# EAGLE schematic host (EAGLE 7.1.0)
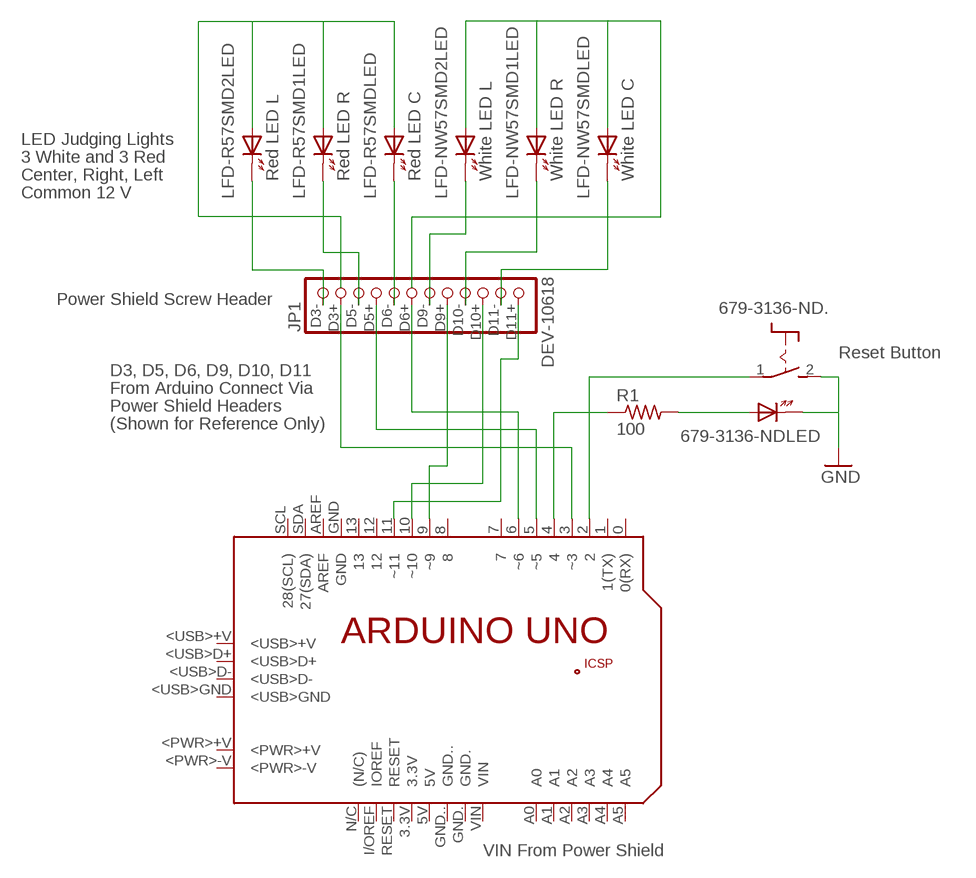
[diagram p0: schematic, sheet 1]

## Parts
679-3136-ND  MARQ6425  [MARQ6425]
JP1  DEV-10618  PINHD-1X12  [1X12]
LFD-NW57SMD  White LED C  MARQ6425  [MARQ6425]
LFD-NW57SMD1  White LED R  MARQ6425  [MARQ6425]
LFD-NW57SMD2  White LED L  MARQ6425  [MARQ6425]
LFD-R57SMD  Red LED C  MARQ6425  [MARQ6425]
LFD-R57SMD1  Red LED R  MARQ6425  [MARQ6425]
LFD-R57SMD2  Red LED L  MARQ6425  [MARQ6425]
PCB1  ARDUINO_UNO  [ARDUINO_UNO]
R1  100  R-US_0204/2V  [0204V]

## Nets
GND: 679-3136-ND.2(.:S) 679-3136-ND.K(LED:K)
N$1: 679-3136-ND.1(.:P) PCB1.2
N$2: PCB1.4 R1.1
N$3: JP1.D11+ PCB1.11(~11)
N$4: JP1.D10+ PCB1.10(~10)
N$5: JP1.D9+ PCB1.9(~9)
N$6: JP1.D3+ PCB1.3(~3)
N$7: JP1.D5+ PCB1.5(~5)
N$8: JP1.D6+ PCB1.6(~6)
N$9: 679-3136-ND.A(LED:A) R1.2
N$10: JP1.D3- LFD-R57SMD2.K(LED:K)
N$11: JP1.D5- LFD-R57SMD1.K(LED:K)
N$12: JP1.D6- LFD-R57SMD.K(LED:K)
N$13: JP1.D11- LFD-NW57SMD.K(LED:K)
N$14: JP1.D10- LFD-NW57SMD1.K(LED:K)
N$15: JP1.D9- LFD-NW57SMD2.K(LED:K)
N$16: LFD-R57SMD1.A(LED:A) LFD-R57SMD2.A(LED:A) LFD-R57SMD.A(LED:A)
N$17: LFD-NW57SMD1.A(LED:A) LFD-NW57SMD2.A(LED:A) LFD-NW57SMD.A(LED:A)
Unconnected: LFD-NW57SMD1.1(.:P) LFD-NW57SMD1.2(.:S) LFD-NW57SMD2.1(.:P) LFD-NW57SMD2.2(.:S) LFD-NW57SMD.1(.:P) LFD-NW57SMD.2(.:S) LFD-R57SMD1.1(.:P) LFD-R57SMD1.2(.:S) LFD-R57SMD2.1(.:P) LFD-R57SMD2.2(.:S) LFD-R57SMD.1(.:P) LFD-R57SMD.2(.:S) PCB1.0(0(RX)) PCB1.1(1(TX)) PCB1.3.3V PCB1.5V PCB1.7 PCB1.8 PCB1.12 PCB1.13 PCB1.+5V PCB1.<PWR>+V PCB1.<PWR>-V PCB1.<USB>+V PCB1.<USB>D+ PCB1.<USB>D- PCB1.<USB>GND PCB1.A0 PCB1.A1 PCB1.A2 PCB1.A3 PCB1.A4 PCB1.A5 PCB1.AREF PCB1.GND PCB1.GND. PCB1.GND.. PCB1.GND_ PCB1.I/OREF(IOREF) PCB1.MISO PCB1.MOSI PCB1.N/C((N/C)) PCB1.RESET PCB1.RESET. PCB1.SCK PCB1.SCL(28(SCL)) PCB1.SDA(27(SDA)) PCB1.VIN

## Notes on the sheet
- LED Judging Lights
- 3 White and 3 Red
- Center, Right, Left
- Common 12 V
- Power Shield Screw Header
- Reset Button
- D3, D5, D6, D9, D10, D11
- From Arduino Connect Via
- Power Shield Headers
- (Shown for Reference Only)
- VIN From Power Shield

## Library data of the parts
679-3136-ND LFD-NW57SMD LFD-NW57SMD1 LFD-NW57SMD2 LFD-R57SMD LFD-R57SMD1 LFD-R57SMD2 = switch:MARQ6425: DIL SWITCH with LED, Marquardt
JP1 = adafruit:PINHD-1X12: PIN HEADER
PCB1 = E14_Arduino_published:ARDUINO_UNO: Device for representing an Arduino Uno board with a footprint in an EAGLE design. Created by Dave Young for Element14. More EAGLE documentation at: http://www.element14.com/community/community/knode/cadsoft_eagle
R1 = resistor:R-US_: RESISTOR, American symbol